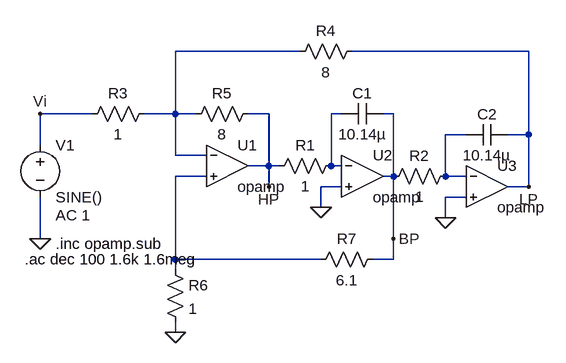
[diagram p0: schematic tpLab_norm.asc]
tpLab_norm.asc, the LTspice schematic file:
Version 4
SHEET 1 880 680
WIRE 288 -16 96 -16
WIRE 640 -16 368 -16
WIRE -32 80 -112 80
WIRE 96 80 96 -16
WIRE 96 80 48 80
WIRE 128 80 96 80
WIRE 240 80 208 80
WIRE 352 80 336 80
WIRE 432 80 416 80
WIRE 544 112 512 112
WIRE 640 112 640 -16
WIRE 640 112 608 112
WIRE -112 128 -112 80
WIRE 96 144 96 80
WIRE 144 144 96 144
WIRE 240 160 240 80
WIRE 240 160 208 160
WIRE 256 160 240 160
WIRE 336 160 336 80
WIRE 352 160 336 160
WIRE 144 176 96 176
WIRE 432 176 432 80
WIRE 432 176 416 176
WIRE 512 176 512 112
WIRE 544 176 512 176
WIRE 240 192 240 160
WIRE 352 192 320 192
WIRE 640 192 640 112
WIRE 640 192 608 192
WIRE 544 208 512 208
WIRE 320 224 320 192
WIRE 512 240 512 208
WIRE -112 272 -112 208
WIRE 432 272 432 176
WIRE 96 304 96 176
WIRE 320 304 96 304
WIRE 432 304 432 272
WIRE 432 304 400 304
WIRE 96 320 96 304
WIRE 96 416 96 400
FLAG -112 272 0
FLAG -112 80 Vi
FLAG 240 192 HP
FLAG 96 416 0
FLAG 320 224 0
FLAG 512 240 0
FLAG 640 192 LP
FLAG 432 272 BP
SYMBOL OpAmps\\opamp 176 96 R0
SYMATTR InstName U1
SYMATTR SpiceLine Aol=10Meg
SYMATTR SpiceLine2 GBW=10000000Meg
SYMBOL res 352 144 R90
WINDOW 0 0 56 VBottom 2
WINDOW 3 32 56 VTop 2
SYMATTR InstName R1
SYMATTR Value 1
SYMBOL res 528 160 R90
WINDOW 0 0 56 VBottom 2
WINDOW 3 32 56 VTop 2
SYMATTR InstName R2
SYMATTR Value 1
SYMBOL res 64 64 R90
WINDOW 0 0 56 VBottom 2
WINDOW 3 32 56 VTop 2
SYMATTR InstName R3
SYMATTR Value 1
SYMBOL cap 416 64 R90
WINDOW 0 0 32 VBottom 2
WINDOW 3 32 32 VTop 2
SYMATTR InstName C1
SYMATTR Value 10.14µ
SYMBOL voltage -112 112 R0
WINDOW 123 24 124 Left 2
WINDOW 39 0 0 Left 0
SYMATTR Value2 AC 1
SYMATTR InstName V1
SYMATTR Value SINE()
SYMBOL OpAmps\\opamp 384 112 R0
SYMATTR InstName U2
SYMATTR SpiceLine Aol=10Meg
SYMATTR SpiceLine2 GBW=10000000Meg
SYMBOL OpAmps\\opamp 576 128 R0
SYMATTR InstName U3
SYMATTR SpiceLine Aol=10Meg
SYMATTR SpiceLine2 GBW=10000000Meg
SYMBOL res 384 -32 R90
WINDOW 0 0 56 VBottom 2
WINDOW 3 32 56 VTop 2
SYMATTR InstName R4
SYMATTR Value 8
SYMBOL res 224 64 R90
WINDOW 0 0 56 VBottom 2
WINDOW 3 32 56 VTop 2
SYMATTR InstName R5
SYMATTR Value 8
SYMBOL res 416 288 R90
WINDOW 0 0 56 VBottom 2
WINDOW 3 32 56 VTop 2
SYMATTR InstName R7
SYMATTR Value 6.1
SYMBOL cap 608 96 R90
WINDOW 0 0 32 VBottom 2
WINDOW 3 32 32 VTop 2
SYMATTR InstName C2
SYMATTR Value 10.14µ
SYMBOL res 80 304 R0
SYMATTR InstName R6
SYMATTR Value 1
TEXT -88 280 Left 2 !.inc opamp.sub
TEXT -136 304 Left 2 !.ac dec 100 1.6k 1.6meg

The netlist it stands for:
* tpLab_norm.asc
XU1 N001 N004 HP opamp Aol=10Meg GBW=10000000Meg  ; pins invin noninvin out
R1 N002 HP 1
R2 N003 BP 1
R3 N001 Vi 1
C1 BP N002 10.14µ
V1 Vi 0 SINE() AC 1
XU2 N002 0 BP opamp Aol=10Meg GBW=10000000Meg  ; pins invin noninvin out
XU3 N003 0 LP opamp Aol=10Meg GBW=10000000Meg  ; pins invin noninvin out
R4 LP N001 8
R5 HP N001 8
R7 BP N004 6.1
C2 LP N003 10.14µ
R6 N004 0 1
.inc opamp.sub
.ac dec 100 1.6k 1.6meg
.backanno
.end

* Results of the author's LTspice run, read from the files saved beside the schematic
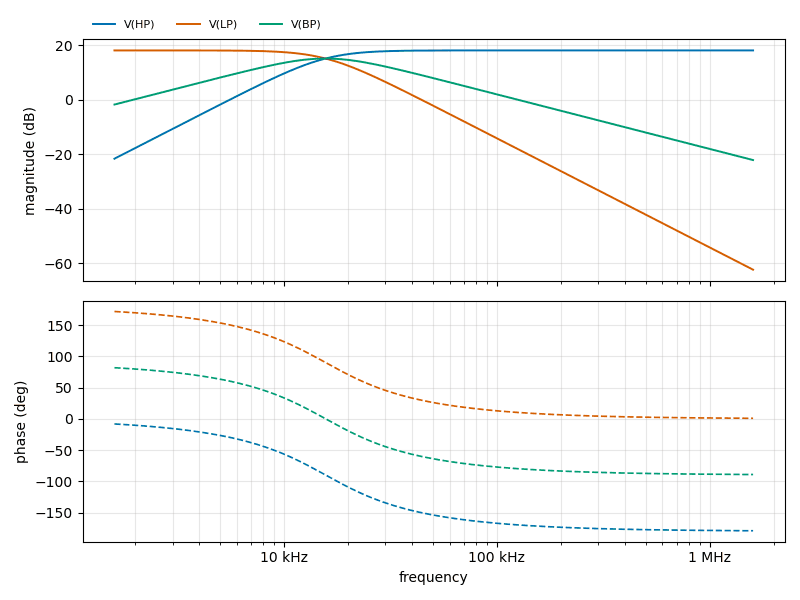
[diagram p1: AC Analysis of tpLab_norm.asc, plotted from the saved traces]
* AC Analysis, 1 run:
*   V(HP): -21.60 dB at 1.6 kHz, 18.06 dB at 1.6 MHz, peak 18.06 dB at 175.4 kHz, 3 dB below the peak at 15.63 kHz
*   V(LP): 18.06 dB at 1.6 kHz, -62.27 dB at 1.6 MHz, peak 18.06 dB at 1.6 kHz, 3 dB below the peak at 15.76 kHz
*   V(BP): -1.77 dB at 1.6 kHz, -22.10 dB at 1.6 MHz, peak 15.09 dB at 15.64 kHz, 3 dB below the peak at 8.144 kHz and 30.25 kHz